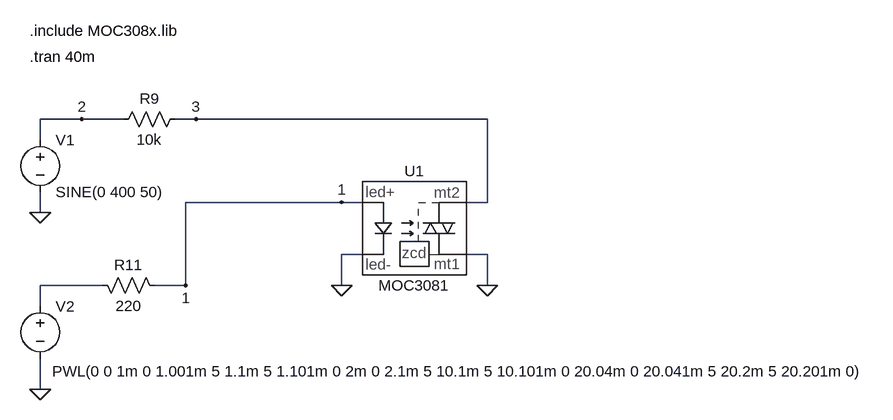
[diagram p0: schematic moc_308x_test.asc]
moc_308x_test.asc, the LTspice schematic file:
Version 4
SHEET 1 1284 692
WIRE -752 -192 -816 -192
WIRE -688 -192 -752 -192
WIRE -576 -192 -608 -192
WIRE -128 -192 -576 -192
WIRE -816 -160 -816 -192
WIRE -352 -64 -592 -64
WIRE -320 -64 -352 -64
WIRE -128 -64 -128 -192
WIRE -128 -64 -160 -64
WIRE -816 -48 -816 -80
WIRE -320 16 -352 16
WIRE -128 16 -160 16
WIRE -720 64 -816 64
WIRE -592 64 -592 -64
WIRE -592 64 -640 64
WIRE -352 64 -352 16
WIRE -128 64 -128 16
WIRE -816 96 -816 64
WIRE -816 224 -816 176
FLAG -816 -48 0
FLAG -576 -192 3
FLAG -816 224 0
FLAG -592 64 1
FLAG -352 -64 1
FLAG -352 64 0
FLAG -128 64 0
FLAG -752 -192 2
SYMBOL voltage -816 -176 R0
WINDOW 123 0 0 Left 0
WINDOW 39 0 0 Left 0
SYMATTR InstName V1
SYMATTR Value SINE(0 400 50)
SYMBOL res -592 -208 R90
WINDOW 0 0 56 VBottom 0
WINDOW 3 32 56 VTop 0
SYMATTR InstName R9
SYMATTR Value 10k
SYMBOL voltage -816 80 R0
WINDOW 3 18 116 Left 0
WINDOW 123 0 0 Left 0
WINDOW 39 0 0 Left 0
SYMATTR Value PWL(0 0 1m 0 1.001m 5 1.1m 5 1.101m 0 2m 0 2.1m 5 10.1m 5 10.101m 0 20.04m 0 20.041m 5 20.2m 5 20.201m 0)
SYMATTR InstName V2
SYMBOL res -736 48 M90
WINDOW 0 0 56 VBottom 0
WINDOW 3 32 56 VTop 0
SYMATTR InstName R11
SYMATTR Value 220
SYMBOL LED_TRIAC_ZCS -272 -48 R0
SYMATTR SpiceModel MOC3081
SYMATTR InstName U1
TEXT -832 -288 Left 0 !.tran 40m
TEXT -832 -328 Left 0 !.include MOC308x.lib

The netlist it stands for:
* moc_308x_test.asc
V1 2 0 SINE(0 400 50)
R9 3 2 10k
V2 N001 0 PWL(0 0 1m 0 1.001m 5 1.1m 5 1.101m 0 2m 0 2.1m 5 10.1m 5 10.101m 0 20.04m 0 20.041m 5 20.2m 5 20.201m 0)
R11 N001 1 220
XU1 1 0 3 0 MOC3081  ; pins led+ led- mt2 mt1
.tran 40m
.include MOC308x.lib
.backanno
.end